# Altium project Auxiliary-BMS_master.PrjPcb
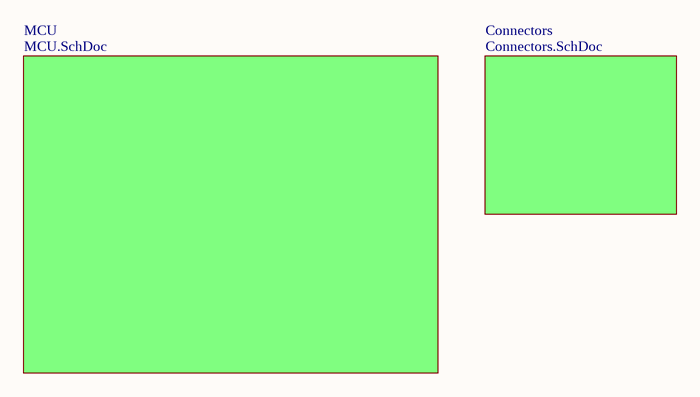
[diagram p0: MainSheet.SchDoc]
3 sheets, 18 parts. Net scope: flat (ports and power ports of the same name join across sheets).
Sheets:
  MainSheet.SchDoc
    MCU = MCU.SchDoc
    Connectors = Connectors.SchDoc

## Sheet MainSheet.SchDoc
size A

### Sub-sheets
Connectors = Connectors.SchDoc: no entries
MCU = MCU.SchDoc: no entries

## Sheet MCU.SchDoc
size A
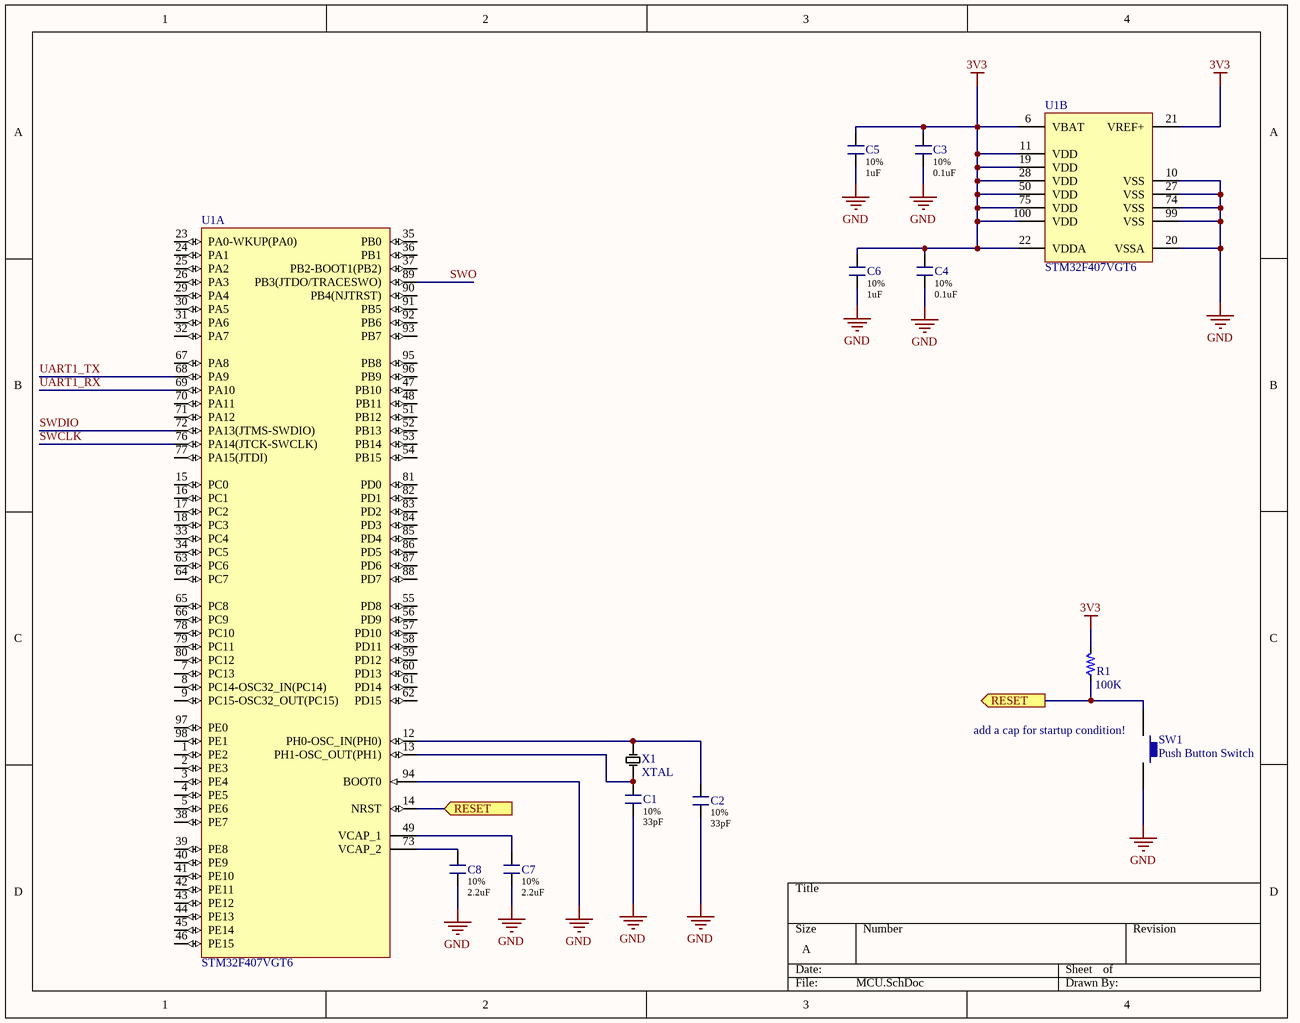
[diagram p1: MCU.SchDoc]

### Parts
C1  Tolerance: 10%  Capacitance: 33pF  [PCB_GENERIC_SMD_0603]  (hidden comment: SCH_GENERIC_CAPACITOR_0603)
C2  Tolerance: 10%  Capacitance: 33pF  [PCB_GENERIC_SMD_0603]  (hidden comment: SCH_GENERIC_CAPACITOR_0603)
C3  Tolerance: 10%  Capacitance: 0.1uF  [PCB_GENERIC_SMD_0603]  (hidden comment: SCH_GENERIC_CAPACITOR_0603)
C4  Tolerance: 10%  Capacitance: 0.1uF  [PCB_GENERIC_SMD_0603]  (hidden comment: SCH_GENERIC_CAPACITOR_0603)
C5  Tolerance: 10%  Capacitance: 1uF  [PCB_GENERIC_SMD_0603]  (hidden comment: SCH_GENERIC_CAPACITOR_0603)
C6  Tolerance: 10%  Capacitance: 1uF  [PCB_GENERIC_SMD_0603]  (hidden comment: SCH_GENERIC_CAPACITOR_0603)
C7  Tolerance: 10%  Capacitance: 2.2uF  [PCB_GENERIC_SMD_0603]  (hidden comment: SCH_GENERIC_CAPACITOR_0603)
C8  Tolerance: 10%  Capacitance: 2.2uF  [PCB_GENERIC_SMD_0603]  (hidden comment: SCH_GENERIC_CAPACITOR_0603)
R1  Resistance: 100K  [PCB_GENERIC_SMD_0603]  (hidden comment: SCH_GENERIC_RESISTOR_0603)
SW1  Push Button Switch  [Push Button Switch]
U1  STM32F407VGT6  [STM-LQFP100_N]  (parts A,B of 2)
X1  XTAL  [CRYSTAL_8MHZ]

### Ports
RESET (in), RESET (out)

### Nets
3V3: C3.2 C4.2 C5.2 C6.2 R1.2 U1.6(VBAT) U1.11(VDD) U1.19(VDD) U1.21(VREF+) U1.22(VDDA) U1.28(VDD) U1.50(VDD) U1.75(VDD) U1.100(VDD)
GND: C1.1 C2.1 C3.1 C4.1 C5.1 C6.1 C7.1 C8.1 SW1.2 U1.10(VSS) U1.20(VSSA) U1.27(VSS) U1.74(VSS) U1.94(BOOT0) U1.99(VSS)
SWCLK: U1.76(PA14(JTCK-SWCLK))
SWDIO: U1.72(PA13(JTMS-SWDIO))
SWO: U1.89(PB3(JTDO/TRACESWO))
UART1_RX: U1.69(PA10)
UART1_TX: U1.68(PA9)
NetC1_2: C1.2 U1.13(PH1-OSC_OUT(PH1)) X1.1
NetC2_2: C2.2 U1.12(PH0-OSC_IN(PH0)) X1.2
NetC7_2: C7.2 U1.49(VCAP_1)
NetC8_2: C8.2 U1.73(VCAP_2)
NetP1_15: R1.1 SW1.1 U1.14(NRST) ; port RESET

Not connected (* = marked no-connect by the designer): U1 1(PE2) 2(PE3) 3(PE4) 4(PE5) 5(PE6) 7(PC13) 8(PC14-OSC32_IN(PC14)) 9(PC15-OSC32_OUT(PC15)) 15(PC0) 16(PC1) 17(PC2) 18(PC3) 23(PA0-WKUP(PA0)) 24(PA1) 25(PA2) 26(PA3) 29(PA4) 30(PA5) 31(PA6) 32(PA7) 33(PC4) 34(PC5) 35(PB0) 36(PB1) 37(PB2-BOOT1(PB2)) 38(PE7) 39(PE8) 40(PE9) 41(PE10) 42(PE11) 43(PE12) 44(PE13) 45(PE14) 46(PE15) 47(PB10) 48(PB11) 51(PB12) 52(PB13) 53(PB14) 54(PB15) 55(PD8) 56(PD9) 57(PD10) 58(PD11) 59(PD12) 60(PD13) 61(PD14) 62(PD15) 63(PC6) 64(PC7) 65(PC8) 66(PC9) 67(PA8) 70(PA11) 71(PA12) 77(PA15(JTDI)) 78(PC10) 79(PC11) 80(PC12) 81(PD0) 82(PD1) 83(PD2) 84(PD3) 85(PD4) 86(PD5) 87(PD6) 88(PD7) 90(PB4(NJTRST)) 91(PB5) 92(PB6) 93(PB7) 95(PB8) 96(PB9) 97(PE0) 98(PE1)

### Notes on the sheet
- (near SW1) add a cap for startup condition!

### Library data of the parts
C1-C8 = SCH_GENERIC_CAPACITOR_0603: Generic SMD capacitor 0603
R1 = SCH_GENERIC_RESISTOR_0603: Generic SMD resistor 0603
SW1 = PushButtonSwitch
U1 = STM32F407VGT6: ARM Cortex-M4 32-bit MCU+FPU, 210 DMIPS, 1024 kB Flash, 192 kB Internal RAM, 82 I/Os, 100-pin LQFP, -40 to 85 degC, Tray; Manufacturer: STMicroelectronics; D/A Converter: 2x12-bit; FLASH Size (Prog) (kB): 1024; I/Os (High Current): 82; Internal RAM Size (kB): 192; Operating Frequency(F) (Processor speed) (MHz): 168; Supply Voltage(Vcc) max (V): 3.6; Supply Voltage(Vcc) min (V): 1.8; DatasheetVersion: Rev. 4; PackageVersion: Rev. 1, 06/2013; PackageReference: LQFP100; PackageDescription: 100-Pin Low Profile Quad Flat Package, 14 x 14 mm Body, 0.5 mm Pitch; Supplier 1: Digi-Key; Supplier Part Number 1: 497-11605-ND; Supplier 2: Farnell; Supplier Part Number 2: 2064368; Supplier 3: Newark; Supplier Part Number 3: 73T2333; Supplier 4: Mouser; Supplier Part Number 4: 511-STM32F407VGT6; Core: ARM Cortex-M4; Packing: Tray; Mounting Technology: Surface Mount; PartNumber: STM32F407VGT6; ComponentLink1Description: Manufacturer URL; ComponentLink1URL: http://www.st.com/web/en/home.html; ComponentLink2Description: Datasheet; ComponentLink2URL: http://www.st.com/st-web-ui/static/active/en/resource/technical/document/datasheet/DM00037051.pdf; ComponentLink3Description: Package Specification; ComponentLink3URL: http://www.st.com/st-web-ui/static/active/en/resource/technical/document/data_brief/DM00071938.pdf
X1 = Crystal: Frequency: 8MHz

## Sheet Connectors.SchDoc
size A
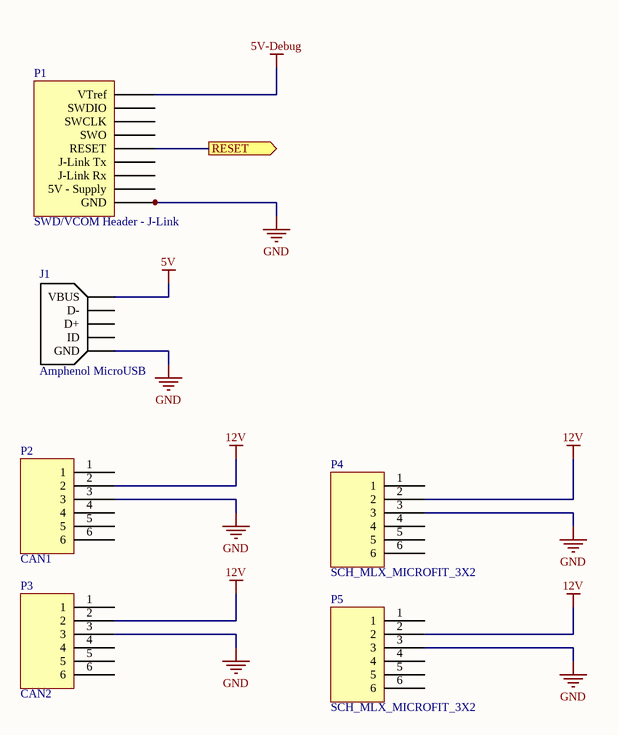
[diagram p2: Connectors.SchDoc]

### Parts
J1  Amphenol MicroUSB  [Amphenol MicroUSB]
P1  SWD/VCOM Header - J-Link  [20 Pin 100 Mil Shrouded header with key]
P2  CAN1  [PCB_MLX_MICROFIT_3X2]
P3  CAN2  [PCB_MLX_MICROFIT_3X2]
P4  SCH_MLX_MICROFIT_3X2  [PCB_MLX_MICROFIT_3X2]
P5  SCH_MLX_MICROFIT_3X2  [PCB_MLX_MICROFIT_3X2]

### Ports
RESET (out)

### Nets
5V: J1.1(VBUS)
5V-Debug: P1.1(VTref)
12V: P2.2 P3.2 P4.2 P5.2
GND: J1.5(GND) P1.4(GND) P1.6(GND) P1.8(GND) P1.10(GND) P1.12(GND) P2.3 P3.3 P4.3 P5.3
NetP1_15: P1.15(RESET) ; port RESET

Not connected (* = marked no-connect by the designer): J1 2(D-) 3(D+) 4(ID); P1 5(J-Link_Tx) 7(SWDIO) 9(SWCLK) 13(SWO) 17(J-Link_Rx) 19(5V_-_Supply); P2 1 4 5 6; P3 1 4 5 6; P4 1 4 5 6; P5 1 4 5 6

### Library data of the parts
J1 = Amphenol MicroUSB - 609-4618-1-ND
P1 = SWD/VCOM Header
P2 P3 = SCH_MLX_MICROFIT_3X2
  P2: ID: CAN1
  P3: ID: CAN2

## Nets that join several sheets
GND: MCU (15 pins), Connectors (10 pins)
NetP1_15: MCU (R1.1 SW1.1 U1.14), Connectors (P1.15)